# Altium schematic sheet V1.0.SchDoc
size 101 x 50 mm
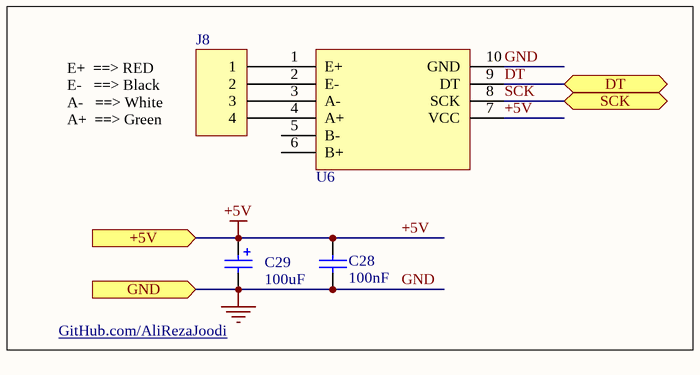
[diagram p0: V1.0.SchDoc]

## Parts
C28  100nF  [CAPNTO2.54-3.05x1.78A]
C29  100uF  [CAPPR2.5-6.3x5]
J8  4Pin  [Fonics_4PIN_1]  (value not drawn)
U6  HX711  [HX711]  (value not drawn)

## Ports
+5V (in), DT, GND (in), SCK

## Nets
+5V: C28.2 C29.1 U6.7(VCC) ; port +5V
GND: C28.1 C29.2 U6.10(GND) ; port GND
DT: U6.9(DT) ; port DT
SCK: U6.8(SCK) ; port SCK
NetJ8_1: J8.1 U6.1(E+)
NetJ8_2: J8.2 U6.2(E-)
NetJ8_3: J8.3 U6.3(A-)
NetJ8_4: J8.4 U6.4(A+)

Not connected (* = marked no-connect by the designer): U6 5(B-) 6(B+)

## Notes on the sheet
- E+  ==> RED
  E-   ==> Black
  A-   ==> White
  A+  ==> Green
- (near C29) GitHub.com/AliRezaJoodi

## Library data of the parts
C28 = Cap: Capacitor; Manufacturer: Generic Components; Class I: Passive; Published: 8-Jun-2000; Revision: July-2002: Re-released for DXP Platform.; Publisher: Altium Limited; Class II: Capacitor
C29 = Cap Pol1: Polarized Capacitor (Radial); Manufacturer: Generic Components; Class I: Passive; Published: 8-Jun-2000; Revision: July-2002: Re-released for DXP Platform.; Publisher: Altium Limited; Class II: Capacitor
J8 = Header 4: Header, 4-Pin; Manufacturer: Generic Components; Class I: Connector; Revision: July-2002: Re-released for DXP Platform.; Publisher: Altium Limited
U6 = HX711: Header, 6-Pin; Manufacturer: Generic Components; Class I: Connector; Revision: July-2002: Re-released for DXP Platform.; Publisher: Altium Limited